# Altium schematic sheet so do nguyen li dau bao khoi_nhiet.SchDoc
size A4; SheetNumber: 2; SheetTotal: 2
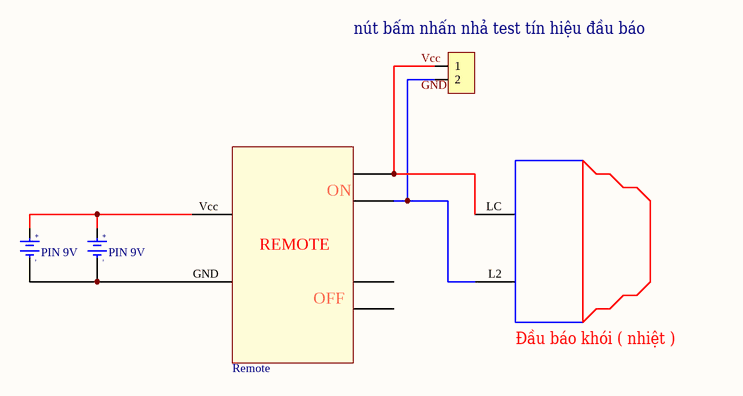
[diagram p0: so do nguyen li dau bao khoi_nhiet.SchDoc]

## Parts
(Parts that share a designator on the sheet are numbered #1, #2 ... from top to bottom, then left to right.)
*#1  dau bao khoai hoac nhiet  (value not drawn)
*#2  Remote
BT?#1  PIN 9V  [PIN3V]
BT?#2  PIN 9V  [PIN3V]
JP?  nút bấm nhấn nhả test tín hiệu đầu báo  [JP 1x2 CC]

## Nets
Vcc: *#1.LC *#2.38 JP?.1
Net*#1_L2: *#1.L2 *#2.39 JP?.2
Net*#2_GND: *#2.GND BT?#1.2(GND) BT?#2.2(GND)
Net*#2_Vcc: *#2.Vcc BT?#1.1(+3V) BT?#2.1(+3V)

Not connected (* = marked no-connect by the designer): *#2 40 41

## Notes on the sheet
- Labels drawn without touching a wire or pin: GND
- (in symbol dau bao khoai hoac nhiet) Đầu báo khói ( nhiệt )
- (in symbol PIN 3V) +; -
- (in symbol Remote) ON; REMOTE; OFF

## Library data of the parts
BT?#1 BT?#2 = PIN 3V: Battery 3VDC; Value: PIN 3V
JP? = JP 1x2 2.54 Cai Cong: Cắm; Ten_Linh_Kien: Jump Đơn Cái 2.54MM 1x40P Cong; Don_Vi: Con; Ma_Hang: MH001265; Ghi_Chu: *; Kieu_Chan: *; Chung_Loai: Cắm